# Altium schematic sheet schematics.SchDoc (part 2 of 3)
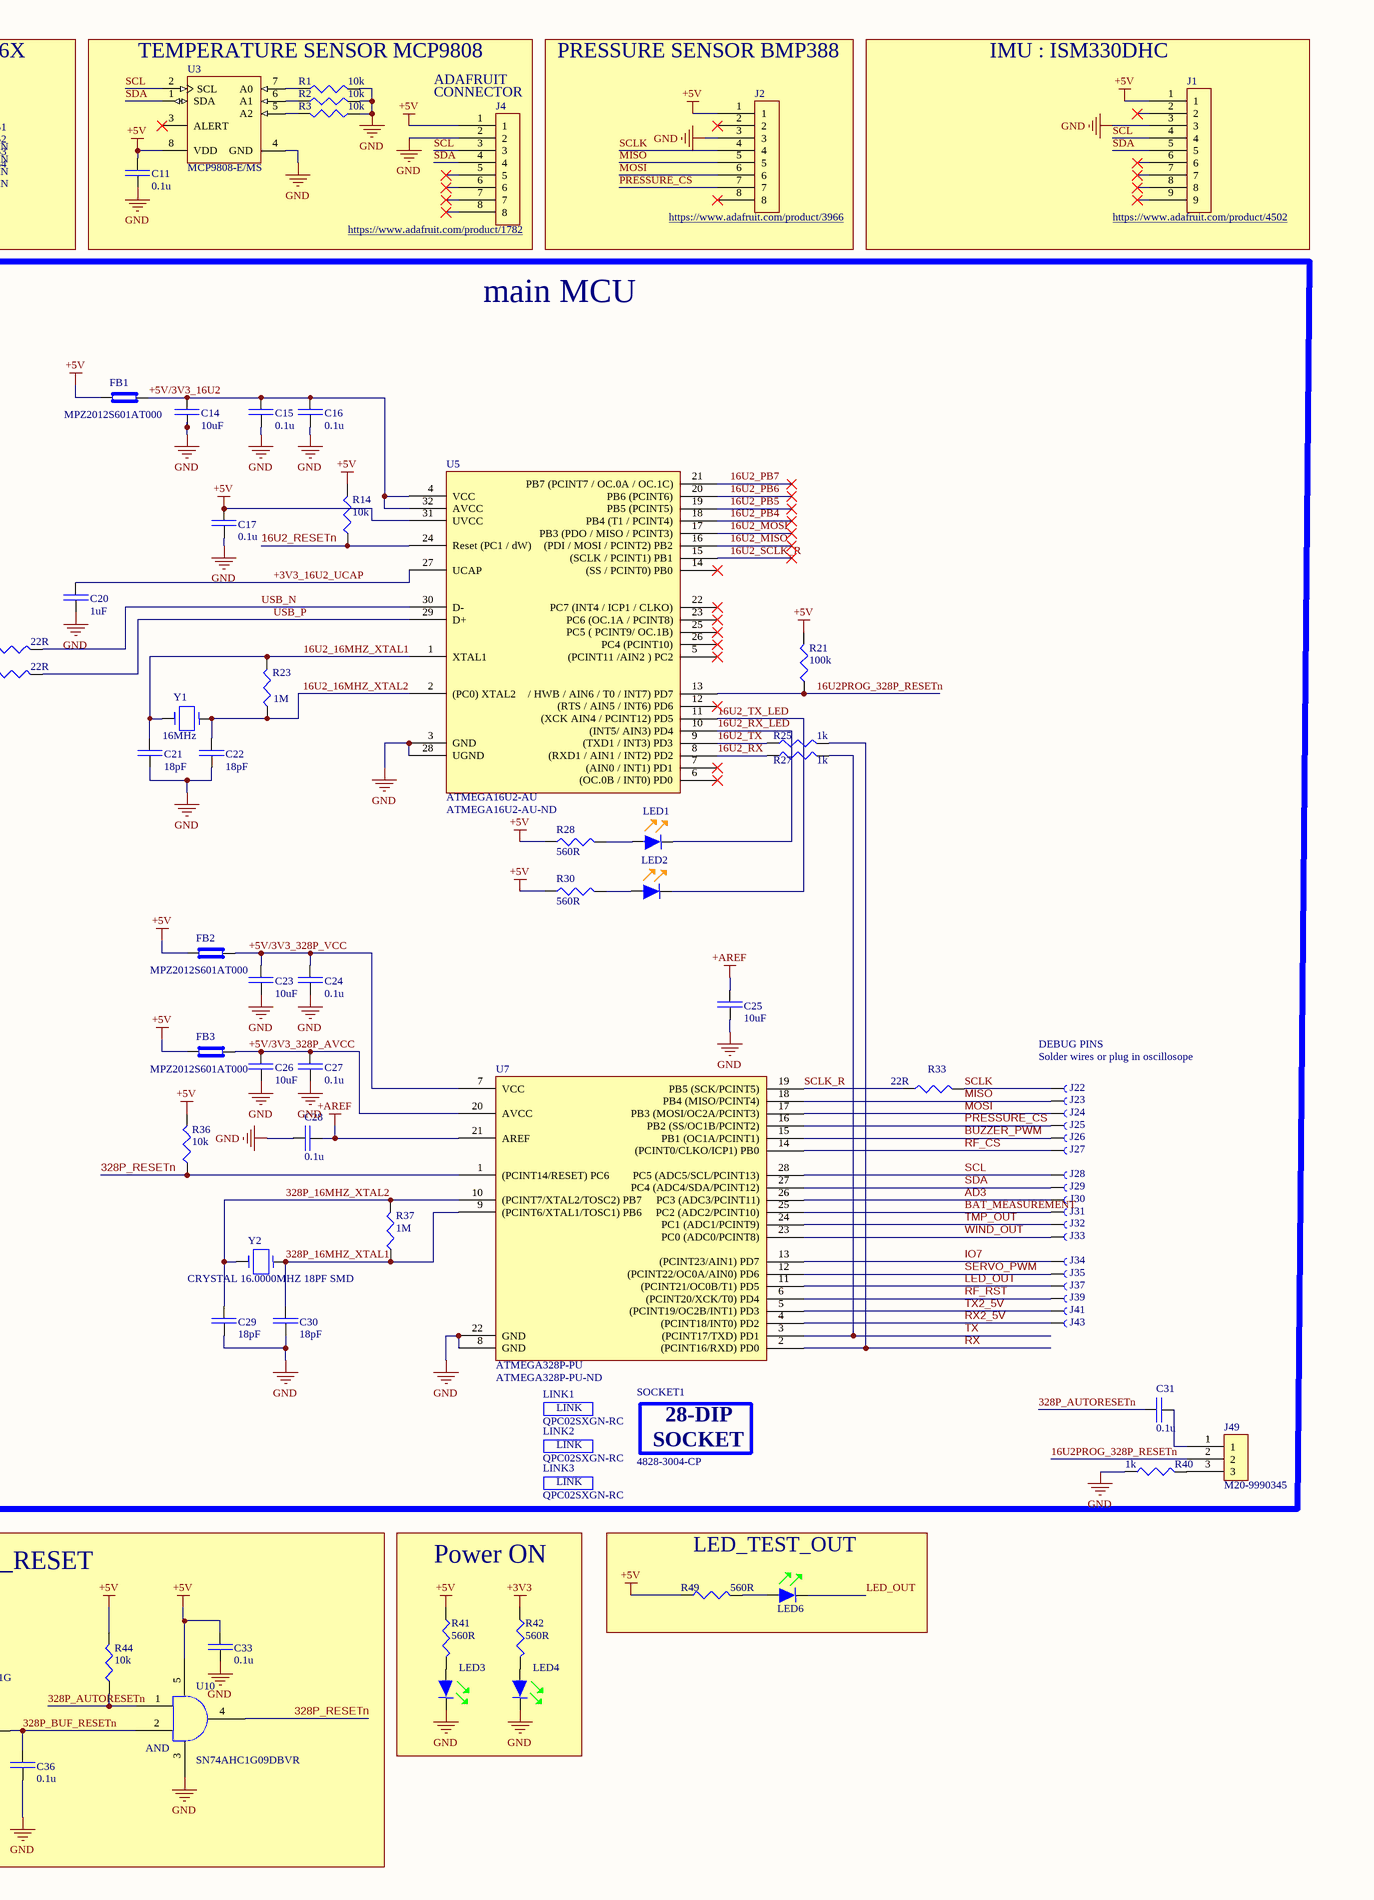
[diagram p2: schematics.SchDoc, right]
## Library data of the parts
BUZZER1 = PS1420P02CT: AUDIO PIEZO TRANSDUCER 30V TH; Manufacturer: TDK; Number of Terminals/Pins: 2; Frequency: 2kHz; Max Supply Voltage: 5V; Washable: No; Supplier 1: Digi-Key; Manufacturer Part Number: PS1420P02CT; RoHS: Yes; Category: Audio Products; Stock 1: 2916; Pricing 1: 1=0.72000, 10=0.61600, 25=0.57600, 50=0.54660, 100=0.51760 (USD); Mount: Through Hole; Case/Package: Radial; Min Operating Temperature: -10°C; Max Operating Temperature: 70°C; Termination: PC Pins; Packaging: Tape and Reel; Package Quantity: 1; Self Resonant Frequency: 2kHz; Voltage Rating (DC): 5V; Diameter: 14mm; Height: 11mm; Lead Free: Lead Free; REACH SVHC: No SVHC; ComponentLink1URL: https://datasheet.ciiva.com/1743/84905-1743655.pdf?src-supplier=Newark; ComponentLink1Description: https://datasheet.ciiva.com/1743/84905-1743655.pdf?src-supplier=Newark; ComponentLink2URL: https://datasheet.ciiva.com/1324/1740412-1324104.pdf?src-supplier=Element14; ComponentLink2Description: https://datasheet.ciiva.com/1324/1740412-1324104.pdf?src-supplier=Element14; ComponentLink3URL: https://datasheet.ciiva.com/4625/ef532-ps-4625338.pdf?src-supplier=Mouser; ComponentLink3Description: https://datasheet.ciiva.com/4625/ef532-ps-4625338.pdf?src-supplier=Mouser; ComponentLink4URL: https://datasheet.ciiva.com/16477/ef532-ps-16477598.pdf?src-supplier=Future+Electronics; ComponentLink4Description: https://datasheet.ciiva.com/16477/ef532-ps-16477598.pdf?src-supplier=Future+Electronics; ComponentLink5URL: https://datasheet.ciiva.com/0/ef532-ps-117.pdf?src-supplier=Digi-Key; ComponentLink5Description: https://datasheet.ciiva.com/0/ef532-ps-117.pdf?src-supplier=Digi-Key; ComponentLink6URL: https://datasheet.ciiva.com/0/ef532-ps-118.pdf?src-supplier=Digi-Key; ComponentLink6Description: https://datasheet.ciiva.com/0/ef532-ps-118.pdf?src-supplier=Digi-Key; ComponentLink7URL: https://datasheet.ciiva.com/8113/ef532-ps-8113417.pdf?src-supplier=Avnet; ComponentLink7Description: https://datasheet.ciiva.com/8113/ef532-ps-8113417.pdf?src-supplier=Avnet; Supplier Part Number 1: 445-2526-1-ND
C1 C6 C9 C11 C13 C15-C17 C24 C27 C28 C31 C33-C37 = CL10B104KB8NNNL: CL10 Series 0603 0.1 uF 50 V ±10% Tolerance X7R Multilayer Ceramic Capacitor; Manufacturer: Samsung; Capacitance: 100nF; Voltage Rating: 50V; Supplier 1: Digi-Key; Manufacturer Part Number: CL10B104KB8NNNL; RoHS: Yes; Category: Ceramic Capacitors; Stock 1: 4930902; Pricing 1: 1=0.10000, 10=0.02900, 50=0.01580, 100=0.01280, 500=0.00916, 1000=0.00720, 2500=0.00654, 5000=0.00602 (USD); Mount: Surface Mount; Case/Package: 0603; Min Operating Temperature: -55°C; Max Operating Temperature: 125°C; Tolerance: 10%; Dielectric: X7R; Packaging: Tape and Reel; Package Quantity: 15000; Voltage Rating (DC): 50V; Length: 1.6mm; Width: 0.031inch; Height: 0.8mm; Thickness: 0.035inch; Depth: 0.8mm; Radiation Hardening: No; ComponentLink1URL: https://datasheet.ciiva.com/26838/getdatasheetpartid-357523-26838415.pdf?src-supplier=Verical; ComponentLink1Description: https://datasheet.ciiva.com/26838/getdatasheetpartid-357523-26838415.pdf?src-supplier=Verical; ComponentLink2URL: https://datasheet.ciiva.com/25741/cl10b104kb8nnnl-25741341.pdf?src-supplier=Digi-Key; ComponentLink2Description: https://datasheet.ciiva.com/25741/cl10b104kb8nnnl-25741341.pdf?src-supplier=Digi-Key
  C1 C6 C9 C13 C24 C27 C28: Supplier Part Number 1: 1276-CL10B104KB8NNNLCT-ND
C2 = CMP-13271-004010-1: CL21 Series 0805 4.7uF 25V ±10% Tolerance X5R Multilayer Ceramic Chip Capacitor; Depth: 1.25mm; Package Quantity: 3000; Min Operating Temperature: -55°C; Tolerance: 10%; Radiation Hardening: No; Case Code (Imperial): 0805; Mount: Surface Mount; Length: 2mm; Lead Free: Lead Free; Case/Package: 0805; Voltage Rating: 25V; Case Code (Metric): 2012; Material: Ceramic; Voltage: 25V; Max Operating Temperature: 85°C; Width: 0.049inch; Thickness: 0.055inch; Dielectric: X5R; Height: 1.25mm; Packaging: Tape and Reel; Capacitance: 4.7uF
C3 = CMP-2100-03597-2: 0603 0.22 uF 16 V ±10 % Tolerance X7R SMT Multilayer Ceramic Capacitor; Manufacturer: YAGEO; Manufacturer Part Number: CC0603KRX7R7BB224; Voltage Rating: 16 V; Temperature Coefficient: 15%; Tolerance: 0.1; Lead Free: Yes; Device Class L3: Ceramic Capacitors; Device Class L2: Capacitors; Category: Cap; ComponentLink2Description: Datasheet; Value: 220 nF; Material: Ceramic; Capacitance: 220 nF; Footprint Url: http://www.yageo.com/exep/pages/download/literatures/UPY-C_GEN_24.pdf; Octopart: https://octopart.com/cc0603krx7r7bb224-yageo-6827757; Voltage: 16 V; ComponentLink2URL: http://www.yageo.com/documents/recent/UPY-GPHC_X7R_6.3V-to-50V_18.pdf; RoHS: TRUE; Temperature Range High: +125°C; Temperature Range Low: -55°C; Automotive: No; Digikey Description: 0603 0.22 uF 16 V ±10 % Tolerance X7R SMT Multilayer Ceramic Capacitor; Height: 0.9mm; Package: CC0603-DA; Mouser Description: Multilayer Ceramic Capacitors MLCC - SMD/SMT 220nF 16V X7R 10%; Temperature Characteristic: X7R; Device Class L1: Passive Components; Temperature: -55°C to +125°C
C4 C5 = CMP-13271-002013-1: Cap Ceramic 22uF 16V X5R ±20% SMD 1206 +85°C Embossed T/R; Height: 0.85mm; Min Operating Temperature: -55°C; Thickness: 0.037inch; Depth: 1.6mm; Length: 3.2mm; Tolerance: 20%; Case Code (Imperial): 1206; Capacitance: 22uF; Package Quantity: 1; Radiation Hardening: No; Case/Package: 1206; Dielectric: X5R; Packaging: Tape and Reel; Voltage: 16V; Case Code (Metric): 3216; Width: 0.063inch; Lead Free: Lead Free; Mount: Surface Mount; Voltage Rating: 16V; Max Operating Temperature: 85°C
C7 C21 C22 C29 C30 = 06035A180JAT2A: 0603 18 pF 50V ±5% Tolerance C0G/NP0 Surface Mount Multilayer Ceramic Capacitor; Manufacturer: Kyocera AVX; Dielectric: C0G; Insulation Resistance: 100GR; Temperature Coefficient: 30ppm/°C; Supplier 1: Digi-Key; Manufacturer Part Number: 06035A180JAT2A; RoHS: Yes; Category: Ceramic Capacitors; Stock 1: 137314; Pricing 1: 1=0.10000, 10=0.05700, 50=0.03100, 100=0.02530, 500=0.01810, 1000=0.01422 (USD); Mount: Surface Mount,PCB; Case/Package: 0603; Number of Pins: 2; Case Code (Imperial): 0603; Case Code (Metric): 1608; Contact Plating: Tin,Matte; Dielectric Material: Ceramic; Min Operating Temperature: -55°C; Max Operating Temperature: 125°C; Capacitance: 18pF; Tolerance: 5%; Packaging: Tape and Reel; Voltage Rating (DC): 50V; Voltage Rating: 50V; Package Quantity: 1; Termination: SMD/SMT; Voltage: 50V; Length: 1.6mm; Width: 0.81mm; Height: 0.63mm; Thickness: 0.035inch; Depth: 0.81mm; Radiation Hardening: No; REACH SVHC: No SVHC; Lead Free: Lead Free; ComponentLink1URL: https://datasheet.ciiva.com/1124/84496-1124722.pdf?src-supplier=Element14; ComponentLink1Description: https://datasheet.ciiva.com/1124/84496-1124722.pdf?src-supplier=Element14; ComponentLink2URL: https://datasheet.ciiva.com/150/ccog-150276.pdf?src-supplier=Digi-Key; ComponentLink2Description: https://datasheet.ciiva.com/150/ccog-150276.pdf?src-supplier=Digi-Key; ComponentLink3URL: https://datasheet.ciiva.com/150/ccog-150277.pdf?src-supplier=Digi-Key; ComponentLink3Description: https://datasheet.ciiva.com/150/ccog-150277.pdf?src-supplier=Digi-Key; ComponentLink4URL: https://datasheet.ciiva.com/7855/759117-7855062.pdf?src-supplier=Element14; ComponentLink4Description: https://datasheet.ciiva.com/7855/759117-7855062.pdf?src-supplier=Element14; ComponentLink5URL: https://datasheet.ciiva.com/7855/84496-7855222.pdf?src-supplier=Element14; ComponentLink5Description: https://datasheet.ciiva.com/7855/84496-7855222.pdf?src-supplier=Element14; ComponentLink6URL: https://datasheet.ciiva.com/22699/84496-22699967.pdf?src-supplier=Element14; ComponentLink6Description: https://datasheet.ciiva.com/22699/84496-22699967.pdf?src-supplier=Element14; Supplier Part Number 1: 478-1166-1-ND
C8 C12 = CMP-13271-000003-1: CAP CER 0.33UF 50V X7R 0805; Manufacturer: Samsung Electro-Mechanics; Manufacturer Part Number: CL21B334KBFNNNE; Capacitance: 330nF; Temperature Coefficient: 15%; Value: 330nF; Material: Ceramic; Tolerance: 10%; Category: Cap; Temperature Range Low: -55°C; Height: 1.35mm; Ipc Land Pattern Name: CAPC200125X125; ComponentLink2URL: http://www.samsungsem.com/kr/support/product-search/mlcc/__icsFiles/afieldfile/2018/07/24/CL21B334KBFNNNE.pdf; Octopart: https://octopart.com/cl21b334kbfnnne-samsung-9287149; Digikey Description: CAP CER 0.33UF 50V X7R 0805; Automotive: No; ComponentLink2Description: Datasheet; Lead Free: Yes; Voltage Rating: 50V; Device Class L2: Capacitors; Device Class L1: Passive Components; RoHS: TRUE; Temperature: -55°C to +125°C; Package: CL21-F; Temperature Range High: +125°C; Temperature Characteristic: X7R; Device Class L3: Ceramic Capacitors
C10 C20 = CC0603KRX5R8BB105: YAGEO - CC0603KRX5R8BB105 - SMD Multilayer Ceramic Capacitor, 1 &#181;F, 25 V, 0603 [1608 Metric], &#177; 10%, X5R, CC Series; Voltage Rating: 25V; Supplier 1: Digi-Key; Manufacturer: Yageo; Manufacturer Part Number: CC0603KRX5R8BB105; RoHS: Yes; Category: Ceramic Capacitors; Stock 1: 1653494; Pricing 1: 1=0.11000, 10=0.08000, 50=0.04560, 100=0.03770, 500=0.02644, 1000=0.02189 (USD); Mount: Surface Mount; Case/Package: 0603; Number of Pins: 2; Case Code (Metric): 1608; Case Code (Imperial): 0603; Min Operating Temperature: -55°C; Max Operating Temperature: 85°C; Capacitance: 1uF; Tolerance: 10%; Dielectric: X5R; Package Quantity: 1; Packaging: Tape and Reel; Termination: SMD/SMT; Voltage Rating (DC): 25V; Length: 1.6mm; Width: 0.031inch; Height: 0.8mm; Thickness: 0.035inch; Depth: 0.8mm; Radiation Hardening: No; REACH SVHC: No SVHC; Lead Free: Lead Free; Halogen Free: Halogen Free; ComponentLink1URL: https://datasheet.ciiva.com/176/mlccorderingcode-176785.pdf?src-supplier=Digi-Key; ComponentLink1Description: https://datasheet.ciiva.com/176/mlccorderingcode-176785.pdf?src-supplier=Digi-Key; ComponentLink2URL: https://datasheet.ciiva.com/176/mlccorderingcode-176786.pdf?src-supplier=Digi-Key; ComponentLink2Description: https://datasheet.ciiva.com/176/mlccorderingcode-176786.pdf?src-supplier=Digi-Key; ComponentLink3URL: https://datasheet.ciiva.com/176/mlccorderingcode-176787.pdf?src-supplier=Digi-Key; ComponentLink3Description: https://datasheet.ciiva.com/176/mlccorderingcode-176787.pdf?src-supplier=Digi-Key; ComponentLink4URL: https://datasheet.ciiva.com/17436/upy-gphc-x5r-4v-to-50v-12-17436952.pdf?src-supplier=Avnet+Europe; ComponentLink4Description: https://datasheet.ciiva.com/17436/upy-gphc-x5r-4v-to-50v-12-17436952.pdf?src-supplier=Avnet+Europe; ComponentLink5URL: https://datasheet.ciiva.com/7978/1525783-7978171.pdf?src-supplier=Element14; ComponentLink5Description: https://datasheet.ciiva.com/7978/1525783-7978171.pdf?src-supplier=Element14; ComponentLink6URL: https://datasheet.ciiva.com/11586/upy-gphc-x5r-4v-to-50v-12-11586318.pdf?src-supplier=Avnet; ComponentLink6Description: https://datasheet.ciiva.com/11586/upy-gphc-x5r-4v-to-50v-12-11586318.pdf?src-supplier=Avnet; Supplier Part Number 1: 311-1445-1-ND
C14 C23 C25 C26 C32 = CL21A106KOQNNNG: Ceramic capacitor SMD 0805 10 µF 16 V 10 %; Manufacturer: Samsung; Tolerance: 10%; Dielectric: X5R; Voltage: 16V; Supplier 1: Digi-Key; Manufacturer Part Number: CL21A106KOQNNNG; RoHS: Yes; Category: Ceramic Capacitors; Stock 1: 763943; Pricing 1: 1=0.11000, 10=0.08300, 50=0.04500, 100=0.03680, 500=0.02626, 1000=0.02063 (USD); Mount: Surface Mount; Case/Package: 0805; Case Code (Imperial): 0805; Case Code (Metric): 2012; Material: Ceramic; Min Operating Temperature: -55°C; Max Operating Temperature: 85°C; Capacitance: 10uF; Packaging: Tape and Reel; Package Quantity: 3000; Voltage Rating: 16V; Length: 2mm; Width: 0.049inch; Height: 1.25mm; Depth: 1.25mm; Thickness: 0.053inch; ComponentLink1URL: https://datasheet.ciiva.com/25730/cl21a106koqnnng-25730226.pdf?src-supplier=Digi-Key; ComponentLink1Description: https://datasheet.ciiva.com/25730/cl21a106koqnnng-25730226.pdf?src-supplier=Digi-Key; ComponentLink2URL: https://datasheet.ciiva.com/29199/454932-da-01-en-vs-kondensator-0805-29199423.pdf?src-supplier=Conrad; ComponentLink2Description: https://datasheet.ciiva.com/29199/454932-da-01-en-vs-kondensator-0805-29199423.pdf?src-supplier=Conrad
  C23 C26 C32: Supplier Part Number 1: 1276-6455-1-ND
C18 C19 = EEE-1AA101WR: Cap Aluminum 100uF 10V 20% (5 X 5.4mm) SMD 50mA 1000 hr 85°C T/R; Manufacturer: Panasonic; Life (Hours): 1000Hour; Supplier 1: Digi-Key; Manufacturer Part Number: EEE-1AA101WR; RoHS: Yes; Category: Aluminum Electrolytic Capacitors; Stock 1: 120721; Pricing 1: 1=0.35000, 10=0.24300, 50=0.16180, 100=0.13740, 500=0.09702 (USD); Mount: Surface Mount,PCB; Case/Package: Radial; Contact Plating: Tin; Min Operating Temperature: -40°C; Max Operating Temperature: 85°C; Capacitance: 100uF; Tolerance: 20%; Ripple Current: 50mA; Voltage Rating: 10V; Packaging: Tape and Reel; Package Quantity: 1; Voltage Rating (DC): 10V; Termination: SMD/SMT; Ripple Current (AC): 50mA; Diameter: 5mm; Length: 5.5mm; Height: 5.4mm; Height - Seated (Max): 0.213inch; Radiation Hardening: No; Lead Free: Lead Free; REACH SVHC: Unknown; ComponentLink1URL: https://datasheet.ciiva.com/26945/getdatasheetpartid-169213-26945071.pdf?src-supplier=Verical; ComponentLink1Description: https://datasheet.ciiva.com/26945/getdatasheetpartid-169213-26945071.pdf?src-supplier=Verical; ComponentLink2URL: https://datasheet.ciiva.com/2983/aba0000ce2-2983906.pdf?src-supplier=Avnet; ComponentLink2Description: https://datasheet.ciiva.com/2983/aba0000ce2-2983906.pdf?src-supplier=Avnet; ComponentLink3URL: https://datasheet.ciiva.com/30075/11aba0000ce2-30075303.pdf?src-supplier=Onlinecomponents.com; ComponentLink3Description: https://datasheet.ciiva.com/30075/11aba0000ce2-30075303.pdf?src-supplier=Onlinecomponents.com; ComponentLink4URL: https://datasheet.ciiva.com/16427/aba0000ce2-16427544.pdf?src-supplier=Future+Electronics; ComponentLink4Description: https://datasheet.ciiva.com/16427/aba0000ce2-16427544.pdf?src-supplier=Future+Electronics; ComponentLink5URL: https://datasheet.ciiva.com/14598/70255710-14598233.pdf?src-supplier=Allied+Electronics; ComponentLink5Description: https://datasheet.ciiva.com/14598/70255710-14598233.pdf?src-supplier=Allied+Electronics; ComponentLink6URL: https://datasheet.ciiva.com/14605/70255710-14605689.pdf?src-supplier=Allied+Electronics; ComponentLink6Description: https://datasheet.ciiva.com/14605/70255710-14605689.pdf?src-supplier=Allied+Electronics; ComponentLink7URL: https://datasheet.ciiva.com/11673/aba0000ce2-11673882.pdf?src-supplier=Avnet; ComponentLink7Description: https://datasheet.ciiva.com/11673/aba0000ce2-11673882.pdf?src-supplier=Avnet; ComponentLink8URL: https://datasheet.ciiva.com/24027/aba0000ce2-40801-24027541.pdf?src-supplier=Mouser; ComponentLink8Description: https://datasheet.ciiva.com/24027/aba0000ce2-40801-24027541.pdf?src-supplier=Mouser; Supplier Part Number 1: PCE3867CT-ND
D1 D2 = BAT54HT1G: Small Signal Schottky Diode, Single, 30 V, 200 mA, 800 mV, 600 mA, 150 C ;RoHS Compliant: Yes; Manufacturer: ON Semiconductor / Fairchild; Forward Voltage: 800mV; Forward Current: 200mA; Recovery Time: 5ns; Max Repetitive Reverse Voltage (Vrrm): 30V; Peak Non-Repetitive Surge Current: 600mA; Max Reverse Current: 2uA; Power Dissipation: 200mW; Polarity: Standard; Capacitance: 10pF; Supplier 1: Digi-Key; Manufacturer Part Number: BAT54HT1G; RoHS: Yes; Category: Schottky Diodes; Stock 1: 187838; Pricing 1: 1=0.20000, 10=0.18100, 100=0.07590, 500=0.05962, 1000=0.04140 (USD); Mount: Surface Mount; Number of Pins: 2; Contact Plating: Tin,Matte; Min Operating Temperature: -55°C; Max Operating Temperature: 150°C; Packaging: Tape and Reel; Package Quantity: 3000; Average Rectified Current: 200mA; Reverse Recovery Time: 5ns; Max Forward Surge Current (Ifsm): 600mA; Element Configuration: Single; Max Reverse Voltage (DC): 30V; Max Surge Current: 600mA; Voltage Rating (DC): 30V; Current Rating: 200mA; Output Current: 200mA; Reverse Voltage: 30V; Max Reverse Leakage Current: 2uA; Length: 1.8mm; Width: 1.35mm; Height: 1mm; Radiation Hardening: No; Lead Free: Lead Free; REACH SVHC: No SVHC; ComponentLink1URL: https://datasheet.ciiva.com/4452/bat54ht1g-104602-4452889.pdf?src-supplier=Mouser; ComponentLink1Description: https://datasheet.ciiva.com/4452/bat54ht1g-104602-4452889.pdf?src-supplier=Mouser; ComponentLink2URL: https://datasheet.ciiva.com/1240/1747983-1240762.pdf?src-supplier=Newark; ComponentLink2Description: https://datasheet.ciiva.com/1240/1747983-1240762.pdf?src-supplier=Newark; ComponentLink3URL: https://datasheet.ciiva.com/34301/806549-34301562.pdf?src-supplier=Jameco; ComponentLink3Description: https://datasheet.ciiva.com/34301/806549-34301562.pdf?src-supplier=Jameco; ComponentLink4URL: https://datasheet.ciiva.com/30479/0900766b811a63a9-30479442.pdf?src-supplier=RSComponents; ComponentLink4Description: https://datasheet.ciiva.com/30479/0900766b811a63a9-30479442.pdf?src-supplier=RSComponents; ComponentLink5URL: https://datasheet.ciiva.com/4714/bat54ht1-d-72881-4714706.pdf?src-supplier=Mouser; ComponentLink5Description: https://datasheet.ciiva.com/4714/bat54ht1-d-72881-4714706.pdf?src-supplier=Mouser; ComponentLink6URL: https://datasheet.ciiva.com/910/bat54ht1g-910498.pdf?src-supplier=Digi-Key; ComponentLink6Description: https://datasheet.ciiva.com/910/bat54ht1g-910498.pdf?src-supplier=Digi-Key; ComponentLink7URL: https://datasheet.ciiva.com/46429/1727620-46429206.pdf?src-supplier=Element14; ComponentLink7Description: https://datasheet.ciiva.com/46429/1727620-46429206.pdf?src-supplier=Element14; ComponentLink8URL: https://datasheet.ciiva.com/915/bat54ht1-d-915444.pdf?src-supplier=Digi-Key; ComponentLink8Description: https://datasheet.ciiva.com/915/bat54ht1-d-915444.pdf?src-supplier=Digi-Key; ComponentLink9URL: https://datasheet.ciiva.com/910/bat54ht1g-910499.pdf?src-supplier=Digi-Key; ComponentLink9Description: https://datasheet.ciiva.com/910/bat54ht1g-910499.pdf?src-supplier=Digi-Key; ComponentLink10URL: https://datasheet.ciiva.com/8303/bat54ht1g-8303645.pdf?src-supplier=Avnet; ComponentLink10Description: https://datasheet.ciiva.com/8303/bat54ht1g-8303645.pdf?src-supplier=Avnet; ComponentLink11URL: https://datasheet.ciiva.com/1180/bat54ht1-d-1180251.pdf?src-supplier=Element14; ComponentLink11Description: https://datasheet.ciiva.com/1180/bat54ht1-d-1180251.pdf?src-supplier=Element14; ComponentLink12URL: https://datasheet.ciiva.com/1180/bat54ht1-d-1180252.pdf?src-supplier=Element14; ComponentLink12Description: https://datasheet.ciiva.com/1180/bat54ht1-d-1180252.pdf?src-supplier=Element14; ComponentLink13URL: https://datasheet.ciiva.com/8294/bat54ht1-d-8294645.pdf?src-supplier=Avnet; ComponentLink13Description: https://datasheet.ciiva.com/8294/bat54ht1-d-8294645.pdf?src-supplier=Avnet; ComponentLink14URL: https://datasheet.ciiva.com/915/bat54ht1-d-915445.pdf?src-supplier=Digi-Key; ComponentLink14Description: https://datasheet.ciiva.com/915/bat54ht1-d-915445.pdf?src-supplier=Digi-Key; ComponentLink15URL: https://datasheet.ciiva.com/915/bat54ht1-d-915443.pdf?src-supplier=Digi-Key; ComponentLink15Description: https://datasheet.ciiva.com/915/bat54ht1-d-915443.pdf?src-supplier=Digi-Key; ComponentLink16URL: https://datasheet.ciiva.com/910/bat54ht1g-910497.pdf?src-supplier=Digi-Key; ComponentLink16Description: https://datasheet.ciiva.com/910/bat54ht1g-910497.pdf?src-supplier=Digi-Key; ComponentLink17URL: https://datasheet.ciiva.com/17020/bat54ht1g-17020445.pdf?src-supplier=Future+Electronics; ComponentLink17Description: https://datasheet.ciiva.com/17020/bat54ht1g-17020445.pdf?src-supplier=Future+Electronics; ComponentLink18URL: https://datasheet.ciiva.com/48686/001262925-da-01-en-diode-schottky-30v-bat54ht1g-sod-323-fsc-48686266.pdf?src-supplier=Conrad; ComponentLink18Description: https://datasheet.ciiva.com/48686/001262925-da-01-en-diode-schottky-30v-bat54ht1g-sod-323-fsc-48686266.pdf?src-supplier=Conrad; Supplier Part Number 1: BAT54HT1GOSCT-ND
FB1-FB3 = MPZ2012S601AT000: FERRITE BEAD 600 OHM 0805 1LN; Manufacturer: TDK; Impedance: 600R; Current Rating: 2A; DC Resistance (DCR): 100mR; Supplier 1: Digi-Key; Manufacturer Part Number: MPZ2012S601AT000; RoHS: Yes; Category: Ferrite Beads and Chips; Stock 1: 163632; Pricing 1: 1=0.11000, 10=0.09200, 25=0.08240, 50=0.06040, 100=0.05220, 250=0.04116, 500=0.03478, 1000=0.02928 (USD); Mount: Surface Mount; Case/Package: 0805; Case Code (Metric): 2012; Case Code (Imperial): 0805; Packaging: Tape and Reel; Package Quantity: 1; Max DC Current: 2A; Length: 0.079inch; Width: 0.049inch; Height: 0.041inch; REACH SVHC: No SVHC; Lead Free: Lead Free; ComponentLink1URL: https://datasheet.ciiva.com/46634/beads-commercial-power-mpz-en-46634377.pdf?src-supplier=Digi-Key; ComponentLink1Description: https://datasheet.ciiva.com/46634/beads-commercial-power-mpz-en-46634377.pdf?src-supplier=Digi-Key; ComponentLink2URL: https://datasheet.ciiva.com/46634/beads-commercial-power-mpz-en-46634606.pdf?src-supplier=Digi-Key; ComponentLink2Description: https://datasheet.ciiva.com/46634/beads-commercial-power-mpz-en-46634606.pdf?src-supplier=Digi-Key; ComponentLink3URL: https://datasheet.ciiva.com/46634/beads-commercial-power-mpz-en-46634335.pdf?src-supplier=Digi-Key; ComponentLink3Description: https://datasheet.ciiva.com/46634/beads-commercial-power-mpz-en-46634335.pdf?src-supplier=Digi-Key; Supplier Part Number 1: 445-2206-1-ND
J1 = ISM330DHCX_adafruit: https://www.adafruit.com/product/4502#technical-details
J2 = BMP388_adafruit: Manufacturer: Harwin; Manufacturer Part Number: M20-7820842; Number of Contacts: 8; Connector Type: Receptacle,Socket; Gender: Female; Max Current Rating: 3A; Contact Resistance: 20mR; Pitch: 2.54mm; Supplier 1: Digi-Key; RoHS: Yes; Category: Headers and Wire Housings; Stock 1: 384; Pricing 1: 1=1.17000, 10=1.03000, 100=0.88880, 500=0.72720, 1000=0.64640, 5000=0.56560, 10000=0.53732 (USD); Mount: Through Hole; Case/Package: SIL; Contact Plating: Tin,Gold; Weight: 0.025397oz; Housing Color: Black; Color: Black; Contact Material: Bronze; Housing Material: Polyamide; Min Operating Temperature: -40°C; Max Operating Temperature: 105°C; Termination: Solder; Number of Rows: 1; Orientation: Straight; Number of Positions: 8; Contact Gender: Female; Package Quantity: 29; Packaging: Rail/Tube; Length: 20.72mm; Depth: 2.5mm; Radiation Hardening: No; ComponentLink1URL: https://datasheet.ciiva.com/16732/m20-782-16732663.pdf?src-supplier=Avnet+Europe; ComponentLink1Description: https://datasheet.ciiva.com/16732/m20-782-16732663.pdf?src-supplier=Avnet+Europe; ComponentLink2URL: https://datasheet.ciiva.com/9480/m20-782-9480074.pdf?src-supplier=Avnet; ComponentLink2Description: https://datasheet.ciiva.com/9480/m20-782-9480074.pdf?src-supplier=Avnet; Supplier Part Number 1: 952-1823-ND
J4 = MCP9808_adafruit
J17 = M20-9760346: 03+03 DIL VERT PIN HDR; Manufacturer: Harwin; Current Rating: 3A; Voltage Rating: 750V; Connector Type: Male Pin; Contact Resistance: 30mR; Number of Positions: 6; Pitch: 2.54mm; Row Spacing: 0.1inch; Supplier 1: Digi-Key; Manufacturer Part Number: M20-9760346; RoHS: Yes; Category: Headers and Wire Housings; Stock 1: 4331; Pricing 1: 1=0.25000, 10=0.23300, 100=0.16120, 500=0.13640, 1000=0.11160, 5000=0.09920, 10000=0.08990 (USD); Mount: Through Hole; Housing Color: Black; Color: Black; Contact Plating: Tin; Housing Material: Nylon; Contact Material: Brass; Min Operating Temperature: -40°C; Max Operating Temperature: 105°C; Orientation: Straight; Package Quantity: 1000; Number of Rows: 2; Packaging: Bulk; Max Current Rating: 3A; Termination: Solder; Length: 7.62mm; Contact Mating Length: 0.228inch; Depth: 5.08mm; ComponentLink1URL: https://datasheet.ciiva.com/6814/m20-976-6814764.pdf?src-supplier=Digi-Key; ComponentLink1Description: https://datasheet.ciiva.com/6814/m20-976-6814764.pdf?src-supplier=Digi-Key; Supplier Part Number 1: 952-1779-ND
J18 = M20-9990546 (3): HEADER, 1ROW, 5WAY; Manufacturer: Harwin; Number of Contacts: 5; Connector Type: Male Pin; Gender: Male; Insulation Resistance: 10GR; Max Current Rating: 3A; Contact Resistance: 30mR; Pitch: 2.54mm; Supplier 1: Digi-Key; Manufacturer Part Number: M20-9990546; RoHS: Yes; Category: Headers and Wire Housings; Stock 1: 48472; Pricing 1: 1=0.21000, 10=0.19500, 100=0.13520, 500=0.11440, 1000=0.09360, 5000=0.08320, 10000=0.07540 (USD); Mount: Through Hole; Case/Package: SIL; Housing Material: Nylon; Contact Material: Brass,Bronze; Contact Plating: Tin; Color: Black; Housing Color: Black; Min Operating Temperature: -40°C; Max Operating Temperature: 105°C; Termination: Solder; Number of Rows: 1; Number of Positions: 5; Current Rating: 3A; Package Quantity: 1000; Packaging: Bulk; Orientation: Straight; Length: 12.7mm; Contact Mating Length: 0.24inch; Depth: 2.54mm; REACH SVHC: No SVHC; ComponentLink1URL: https://datasheet.ciiva.com/11749/0900766b80da602d-11749062.pdf?src-supplier=RSComponents; ComponentLink1Description: https://datasheet.ciiva.com/11749/0900766b80da602d-11749062.pdf?src-supplier=RSComponents; ComponentLink2URL: https://datasheet.ciiva.com/8046/315376-8046940.pdf?src-supplier=Element14; ComponentLink2Description: https://datasheet.ciiva.com/8046/315376-8046940.pdf?src-supplier=Element14; ComponentLink3URL: https://datasheet.ciiva.com/6833/m20-999-6833320.pdf?src-supplier=Digi-Key; ComponentLink3Description: https://datasheet.ciiva.com/6833/m20-999-6833320.pdf?src-supplier=Digi-Key; Supplier Part Number 1: 952-2268-ND
J19 = 10118193-0001LF: CONN USB MICRO B RECPT SMT R/A; Manufacturer: Amphenol FCI; Number of Terminals/Pins: 5; Gender: Female; Connector Type: USB,Receptacle; Number of Ports: 1; Current Rating: 1.8A; Insulation Resistance: 1GR; Max Voltage Rating (AC): 100V; Pitch: 0.65mm; Supplier 1: Digi-Key; Manufacturer Part Number: 10118193-0001LF; RoHS: Yes; Category: USB Connectors; Stock 1: 43804; Pricing 1: 1=0.45000, 10=0.43000, 25=0.36840, 50=0.31320, 100=0.30090, 250=0.27016, 500=0.25788 (USD); Mount: Surface Mount,Horizontal; Contact Plating: Gold; Contact Material: Copper Alloy; Color: Black; Housing Material: Polymer; Min Operating Temperature: -55°C; Max Operating Temperature: 85°C; Termination: Solder; Packaging: Tape and Reel; Number of Contacts: 5; Orientation: Right Angle; Package Quantity: 1200; Voltage Rating: 100V; Features: Shielded; Length: 7.86mm; Depth: 5.67mm; Radiation Hardening: No; Flammability Rating: UL94 V-0; ComponentLink1URL: https://datasheet.ciiva.com/851/10118193-851106.pdf?src-supplier=Digi-Key; ComponentLink1Description: https://datasheet.ciiva.com/851/10118193-851106.pdf?src-supplier=Digi-Key; ComponentLink2URL: https://datasheet.ciiva.com/26853/getdatasheetpartid-418618-26853893.pdf?src-supplier=Verical; ComponentLink2Description: https://datasheet.ciiva.com/26853/getdatasheetpartid-418618-26853893.pdf?src-supplier=Verical; ComponentLink3URL: https://datasheet.ciiva.com/4598/10118193ac-197151-4598799.pdf?src-supplier=Mouser; ComponentLink3Description: https://datasheet.ciiva.com/4598/10118193ac-197151-4598799.pdf?src-supplier=Mouser; ComponentLink4URL: https://datasheet.ciiva.com/14802/10118193-0001lf-webpage-14802386.pdf?src-supplier=Arrow+Electronics; ComponentLink4Description: https://datasheet.ciiva.com/14802/10118193-0001lf-webpage-14802386.pdf?src-supplier=Arrow+Electronics; ComponentLink5URL: https://datasheet.ciiva.com/851/10118193-851107.pdf?src-supplier=Digi-Key; ComponentLink5Description: https://datasheet.ciiva.com/851/10118193-851107.pdf?src-supplier=Digi-Key; ComponentLink6URL: https://datasheet.ciiva.com/851/10118193-851108.pdf?src-supplier=Digi-Key; ComponentLink6Description: https://datasheet.ciiva.com/851/10118193-851108.pdf?src-supplier=Digi-Key; ComponentLink7URL: https://datasheet.ciiva.com/14618/70236827-14618887.pdf?src-supplier=Allied+Electronics; ComponentLink7Description: https://datasheet.ciiva.com/14618/70236827-14618887.pdf?src-supplier=Allied+Electronics; Supplier Part Number 1: 609-4616-1-ND
J21 J49 = M20-9990345: HARWIN - M20-9990345 - Board-To-Board Connector, Straight, 2.54 mm, 3 Contacts, Header, M20 Series, Through Hole, 1 Rows; Number of Contacts: 3; Connector Type: Male Pin; Current Rating: 3A; Contact Resistance: 25mR; Voltage Rating (AC): 750V; Insulation Resistance: 10GR; Pitch: 2.54mm; Supplier 1: Digi-Key; Manufacturer: Harwin; Manufacturer Part Number: M20-9990345; RoHS: Yes; Category: Headers and Wire Housings; Stock 1: 68267; Pricing 1: 1=0.19000, 10=0.17400, 100=0.10730, 500=0.08880, 1000=0.07770, 5000=0.06660, 10000=0.06475 (USD); Mount: Through Hole; Case/Package: SIL; Housing Color: Black; Housing Material: Nylon; Contact Plating: Gold; Contact Material: Brass,Bronze; Color: Black; Weight: 0.006138oz; Min Operating Temperature: -40°C; Max Operating Temperature: 105°C; Number of Rows: 1; Termination: Solder; Package Quantity: 1000; Packaging: Bulk; Max Current Rating: 3A; Number of Positions: 3; Orientation: Straight; Length: 7.62mm; Width: 0.25inch; Height: 0.125inch; Contact Mating Length: 0.24inch; Depth: 2.54mm; Radiation Hardening: No; REACH SVHC: No SVHC; ComponentLink1URL: https://datasheet.ciiva.com/11747/0900766b80da602d-11747505.pdf?src-supplier=RSComponents; ComponentLink1Description: https://datasheet.ciiva.com/11747/0900766b80da602d-11747505.pdf?src-supplier=RSComponents; ComponentLink2URL: https://datasheet.ciiva.com/10151/m20-999-10151334.pdf?src-supplier=Avnet; ComponentLink2Description: https://datasheet.ciiva.com/10151/m20-999-10151334.pdf?src-supplier=Avnet; ComponentLink3URL: https://datasheet.ciiva.com/16657/m20-999-16657084.pdf?src-supplier=Avnet+Europe; ComponentLink3Description: https://datasheet.ciiva.com/16657/m20-999-16657084.pdf?src-supplier=Avnet+Europe; ComponentLink4URL: https://datasheet.ciiva.com/5160/m20-999-351179-5160492.pdf?src-supplier=Mouser; ComponentLink4Description: https://datasheet.ciiva.com/5160/m20-999-351179-5160492.pdf?src-supplier=Mouser; Supplier Part Number 1: 952-2263-ND
J50 = CMP-2000-05415-1: SMA Connector, Pitch 5.08 mm, 1 Position, Height 9.5 mm, Tail Length 4 mm, -65 to 165 degC, RoHS, Bulk; Manufacturer: TE Connectivity; Connector Mounting: PCBMount; Connector Body Style: StraightJack; Impedance: 50ohm; Coaxial Termination: Solder; SVHC: NoSVHC(15-Jun-2015); Frequency Max: 3GHz; Product Range: ZDCSeries; Connector Type: SMACoaxial; Datasheet Version: Rev. B1, 03/2011; Package Reference: 5-1814832-1; Package Description: SMA Connector, Pitch 5.08 mm, 1 Position, Height 9.5 mm, Tail Length 4 mm; Contact Plating: GoldPlatedContacts; Coaxial Cable Types: -; Contact Material: BerylliumCopper; Manufacturer URL: http://www.te.com/; Datasheet URL: http://www.onlinecomponents.com/productFiles/mf-AMP/eng_cd_1814832_a.pdf
L1 = ASPI-4020S-120M-T: Ind Power Shielded Wirewound 12uH 20% 100KHz Ferrite 880mA 1616 T/R; Manufacturer: Abracon; DC Resistance (DCR): 175mR; Max DC Current: 1.5A; Self Resonant Frequency: 26MHz; Supplier 1: Digi-Key; Manufacturer Part Number: ASPI-4020S-120M-T; RoHS: Yes; Category: Fixed Inductors; Pricing 1: 3000=0.16800 (USD); Mount: Surface Mount; Case/Package: Nonstandard; Core Material: Ferrite; Min Operating Temperature: -40°C; Max Operating Temperature: 125°C; Shielding: Shielded; Packaging: Tape and Reel; Tolerance: 20%; Resistor Type: Wirewound; Inductance: 12uH; Current Rating: 880mA; Test Frequency: 100kHz; Termination: SMD/SMT; Package Quantity: 3000; Saturation Current: 1.5A; Length: 0.157inch; Width: 0.157inch; Height: 2mm; Height - Seated (Max): 0.079inch; ComponentLink1URL: http://www.mouser.com/ds/2/3/ASPI-4020S-253634.pdf?src-supplier=Mouser; ComponentLink1Description: http://www.mouser.com/ds/2/3/ASPI-4020S-253634.pdf?src-supplier=Mouser; ComponentLink2URL: http://www.abracon.com/Magnetics/power/ASPI-4020S.pdf?src-supplier=Digi-Key; ComponentLink2Description: http://www.abracon.com/Magnetics/power/ASPI-4020S.pdf?src-supplier=Digi-Key; Supplier Part Number 1: ASPI-4020S-120M-T-ND
L2 = L1210R2R2MDWIT: FIXED IND 2.2UH 2A 80 MOHM SMD; Manufacturer: KEMET; Core Material: Ferrite; Tolerance: 20%; Shielding: Unshielded; Self Resonant Frequency: 190MHz; DC Resistance (DCR): 80mR; Test Frequency: 100kHz; DC Current: 1.13A; Supplier 1: Digi-Key; Manufacturer Part Number: L1210R2R2MDWIT; RoHS: Yes; Category: Fixed Inductors; Stock 1: 16682; Pricing 1: 1=0.48000, 10=0.41700, 25=0.38680, 50=0.32720, 100=0.29750, 250=0.27964, 500=0.24990 (USD); Mount: Surface Mount; Case/Package: 1210; Case Code (Metric): 3225; Case Code (Imperial): 1210; Min Operating Temperature: -40°C; Max Operating Temperature: 105°C; Inductance: 2.2uH; Max DC Current: 2A; Package Quantity: 1000; Current Rating: 2A; Packaging: Tape and Reel; Inductance Tolerance: 20%; Resistor Type: Wirewound,Ceramic; Termination: SMD/SMT; Length: 0.126inch; Width: 0.098inch; Height: 2.5mm; Height - Seated (Max): 0.106inch; Depth: 2.7mm; Radiation Hardening: No; REACH SVHC: No SVHC; Military Standard: Not; ComponentLink1URL: https://datasheet.ciiva.com/4957/f3115-4957838.pdf?src-supplier=Mouser; ComponentLink1Description: https://datasheet.ciiva.com/4957/f3115-4957838.pdf?src-supplier=Mouser; ComponentLink2URL: https://datasheet.ciiva.com/6691/f3115-6691487.pdf?src-supplier=Digi-Key; ComponentLink2Description: https://datasheet.ciiva.com/6691/f3115-6691487.pdf?src-supplier=Digi-Key; ComponentLink3URL: https://datasheet.ciiva.com/8512/f3115-8512543.pdf?src-supplier=Avnet; ComponentLink3Description: https://datasheet.ciiva.com/8512/f3115-8512543.pdf?src-supplier=Avnet; ComponentLink4URL: https://datasheet.ciiva.com/17280/f3115-17280270.pdf?src-supplier=Avnet+Europe; ComponentLink4Description: https://datasheet.ciiva.com/17280/f3115-17280270.pdf?src-supplier=Avnet+Europe; ComponentLink5URL: https://datasheet.ciiva.com/22685/27262-22685038.pdf?src-supplier=Element14; ComponentLink5Description: https://datasheet.ciiva.com/22685/27262-22685038.pdf?src-supplier=Element14; Supplier Part Number 1: 399-9598-1-ND
LED1 LED2 LED5 = LOL29K-H2K1-24-Z: OSRAM - LO L29K-H2K1-24-Z - SMARTLED 0603 ORANGE; Manufacturer: Osram Opto; Lens Color: White; Forward Current: 20mA; Forward Voltage: 2.2V; Luminous Intensity: 9mcd; Viewing Angle: 160°; Test Current: 2mA; Lens Style: Flat,Diffused,Colorless,Rectangular; Dominant Wavelength: 606nm; Luminous Flux: 0.025lm; Number of Elements: 1; Reverse Voltage: 12V; Lens Transparency: Diffused; Lens Size: 0.8mm; Supplier 1: Digi-Key; Manufacturer Part Number: LOL29K-H2K1-24-Z; RoHS: Yes; Category: Uncategorized; Mount: Surface Mount; Case/Package: 0603; Number of Pins: 2; Color: Orange; Case Code (Metric): 1608; Case Code (Imperial): 0603; Min Operating Temperature: -40°C; Max Operating Temperature: 100°C; Packaging: Tape and Reel; Number of LEDs: 1; Illumination Color: Orange; Package Quantity: 5000; Length: 1.3mm; Width: 0.8mm; Height: 0.65mm; Depth: 0.8mm; Radiation Hardening: No; ComponentLink1URL: https://datasheet.ciiva.com/2112/00077105-0-2112904.pdf?src-supplier=Digi-Key; ComponentLink1Description: https://datasheet.ciiva.com/2112/00077105-0-2112904.pdf?src-supplier=Digi-Key; ComponentLink2URL: https://datasheet.ciiva.com/2112/00077105-0-2112905.pdf?src-supplier=Digi-Key; ComponentLink2Description: https://datasheet.ciiva.com/2112/00077105-0-2112905.pdf?src-supplier=Digi-Key; ComponentLink3URL: https://datasheet.ciiva.com/2112/00077105-0-2112906.pdf?src-supplier=Digi-Key; ComponentLink3Description: https://datasheet.ciiva.com/2112/00077105-0-2112906.pdf?src-supplier=Digi-Key; ComponentLink4URL: https://datasheet.ciiva.com/15198/getdatasheetpartid-693885-15198412.pdf?src-supplier=Verical; ComponentLink4Description: https://datasheet.ciiva.com/15198/getdatasheetpartid-693885-15198412.pdf?src-supplier=Verical; Supplier Part Number 1: 475-2740-2-ND
LED3 LED4 LED6 = LGL29K-F2J1-24-Z: LED Uni-Color Green 572nm Automotive 2-Pin Chip 0603(1608Metric) T/R; Manufacturer: Osram Opto; Lens Color: White; Forward Current: 20mA; Forward Voltage: 1.7V; Luminous Intensity: 3.5mcd; Viewing Angle: 160°; Lens Style: Flat,Diffused,Colorless,Rectangular; Lens Transparency: Diffused; Test Current: 2mA; Dominant Wavelength: 570nm; Luminous Flux: 0.015lm; Number of LEDs: 1; Lens Size: 0.8mm; Supplier 1: Digi-Key; Manufacturer Part Number: LGL29K-F2J1-24-Z; RoHS: Yes; Category: Uncategorized; Stock 1: 70173; Pricing 1: 1=0.360000, 10=0.236000, 100=0.157600, 500=0.108980, 1000=0.090820, 2000=0.081740 (USD); Mount: Surface Mount; Case/Package: 0603; Number of Pins: 2; Color: Green; Case Code (Metric): 1608; Case Code (Imperial): 0603; Min Operating Temperature: -40°C; Max Operating Temperature: 100°C; Packaging: Tape and Reel; Package Quantity: 5000; Illumination Color: Green; Length: 1.7mm; Width: 0.8mm; Height: 0.65mm; Radiation Hardening: No; ComponentLink1URL: http://components.arrow.com/part/dataview/41971649S9781339N2128?src-supplier=Arrow+Electronics; ComponentLink1Description: http://components.arrow.com/part/dataview/41971649S9781339N2128?src-supplier=Arrow+Electronics; ComponentLink2URL: http://components.arrow.com/part/dataview/0323_02006818?src-supplier=Arrow+Europe; ComponentLink2Description: http://components.arrow.com/part/dataview/0323_02006818?src-supplier=Arrow+Europe; ComponentLink3URL: http://catalog.osram-os.com/catalogue/catalogue.do;jsessionid=3DE84243E85F820603DAFD5199D8DDA3?act=downloadFile&favOid=020000020000138e000100b6&src-supplier=Avnet; ComponentLink3Description: http://catalog.osram-os.com/catalogue/catalogue.do;jsessionid=3DE84243E85F820603DAFD5199D8DDA3?act=downloadFile&favOid=020000020000138e000100b6&src-supplier=Avnet; ComponentLink4URL: https://dammedia.osram.info/media/resource/hires/osram-dam-2493945/LG%20L29K.pdf?src-supplier=Digi-Key; ComponentLink4Description: https://dammedia.osram.info/media/resource/hires/osram-dam-2493945/LG%20L29K.pdf?src-supplier=Digi-Key; ComponentLink5URL: http://catalog.osram-os.com/catalogue/catalogue.do;jsessionid=3DE84243E85F820603DAFD5199D8DDA3?act=downloadFile&favOid=020000020000138e000100b6&src-supplier=Avnet+Europe; ComponentLink5Description: http://catalog.osram-os.com/catalogue/catalogue.do;jsessionid=3DE84243E85F820603DAFD5199D8DDA3?act=downloadFile&favOid=020000020000138e000100b6&src-supplier=Avnet+Europe; Supplier Part Number 1: 475-3118-1-ND
LINK1-LINK3 = QPC02SXGN-RC: CONN JUMPER SHORTING .100" GOLD; Manufacturer: Sullins; Number of Positions: 2; Pitch: 0.1inch; Supplier 1: Digi-Key; Manufacturer Part Number: QPC02SXGN-RC; RoHS: Yes; Category: Connectors; Stock 1: 770847; Pricing 1: 1=0.10000, 25=0.04400, 50=0.03780, 250=0.03152, 750=0.02835, 1000=0.02646, 12000=0.02016, 24000=0.01827, 48000=0.01820 (USD); Case/Package: 100; Contact Plating: Gold; Package Quantity: 2000; Packaging: Bulk; Height: 0.235inch; Lead Free: Lead Free; ComponentLink1URL: https://datasheet.ciiva.com/767/284-sxgn-11510-767869.pdf?src-supplier=Digi-Key; ComponentLink1Description: https://datasheet.ciiva.com/767/284-sxgn-11510-767869.pdf?src-supplier=Digi-Key; Supplier Part Number 1: S9337-ND
P1 = CMP-1712-00002-4: THT Vertical Pin Header WR-PHD, Pitch 2.54 mm, Single Row, 2 pins; Manufacturer: Wurth Elektronik; Rated Current: 3A; Gender: Male; Withstanding Voltage: 500VAC; Working Voltage: 250VAC; Pitch: 2.54mm; Contact Resistance: 20mOhm; Pin Number: 2; Mounting Technology: THT; Orientation: Vertical; Operating Temperature: -40to105degC; Packaging: Bag; Publisher: WurthElektronik; Datasheet URL: https://katalog.we-online.de/em/datasheet/6130xx11121.pdf; Manufacturer URL: http://www.we-online.de; Row Number: Single; Package Reference: 61300211121; Part Number: 61300211121
Q1-Q4 Q6 = CMP-2000-04930-1: N-Channel Enhancement Mode Mosfet, 50 V, 0.2 A, -55 to 150 degC, 3-Pin SOT23, RoHS, Tape and Reel; Manufacturer: Diodes Inc; Brand: DiodesIncorporated; Unit Weight: 0.000282oz; Pd - Power Dissipation: 300mW; Id - Continuous Drain Current: 200mA; Rds On - Drain-Source Resistance: 3.5Ohms; Vgs - Gate-Source Voltage: 20V; Number of Channels: 1Channel; Vds - Drain-Source Breakdown Voltage: 50V; Transistor Type: 1N-Channel; Typical Turn-Off Delay Time: 20ns; Configuration: Single; Mounting Style: SMD/SMT; Height: 1mm; Package Description: 3-Pin Small Outline Transistor, Body 2.9 x 1.3 mm, Pitch 0.96 mm; Datasheet Version: Rev. 20-2, 11/2013; Minimum Operating Temperature: -55C; Package / Case: SOT-23-3; Channel Mode: Enhancement; Product: MOSFETSmallSignal; Packaging: Reel; Maximum Operating Temperature: +150C; Datasheet URL: https://datasheet.ciiva.com/8115/ds30144-8115344.pdf; Product Category: MOSFET; Width: 1.3mm; Technology: Si; Package Reference: SOT23-3; Manufacturer URL: http://www.diodes.com/; Transistor Polarity: N-Channel; Length: 2.9mm; Factory Pack Quantity: 3000; Series: BSS138; RoHS: True; Typical Turn-On Delay Time: 20ns
Q5 = CMP-2000-05569-1: General Purpose Small Signal Amplifier, 150 mA, 50 V, -55 to 150 degC, 3-Pin SOT23 (SOT-346), RoHS, Tape and Reel; Manufacturer: Rohm; Maximum Operating Frequency: 180MHz; Transistor Type: NPN; Maximum DC Collector Current: 0.15A; Maximum Collector Base Voltage: 60V; Transistor Configuration: Single; Number of Elements per Chip: 1; Minimum DC Current Gain: 180; Maximum Power Dissipation: 0.2W; Maximum Collector Emitter Voltage: 50V; Maximum Emitter Base Voltage: 7V; Maximum Collector Emitter Saturation Voltage: 0.4V; Height: 1.1mm; Minimum Operating Temperature: -55°C; Pin Count: 3; Package Reference: SOT-346; Package Description: 3-Pin Small Outline Transistor, Body 2.9 x 1.65 mm, Pitch 0.95 mm; Width: 1.6mm; Package Type: SMT; Datasheet Version: Rev. 003, 08/2015; Dimensions: 1.1x2.9x1.6mm; Mounting Technology: SurfaceMount; Datasheet URL: http://rohmfs.rohm.com/en/products/databook/datasheet/discrete/transistor/bipolar/2sc2412kt146q-e.pdf; Manufacturer URL: http://www.rohm.com/web/global/; Length: 2.9mm; Mounting Type: SurfaceMount; Maximum Operating Temperature: +150°C
R1-R3 R7-R10 R14-R16 R18 R19 R34-R36 R44-R46 = AC0603FR-0710KL: RES SMD 10K OHM 1% 1/10W 0603; Manufacturer: Yageo; Resistance: 10kR; Power Rating: 100mW; Voltage Rating: 50V; Temperature Coefficient: 100ppm/°C; Supplier 1: Digi-Key; Manufacturer Part Number: AC0603FR-0710KL; RoHS: Yes; Category: Chip SMD Resistors; Stock 1: 1476724; Pricing 1: 1=0.10000, 10=0.02500, 100=0.01020, 1000=0.00458, 2500=0.00398 (USD); Mount: Surface Mount; Case/Package: 0603; Case Code (Imperial): 0603; Case Code (Metric): 1608; Min Operating Temperature: -55°C; Max Operating Temperature: 155°C; Tolerance: 1%; Packaging: Tape and Reel; Package Quantity: 1; Termination: SMD/SMT; Resistor Type: Thick Film; Number of Terminations: 2; Max Power Dissipation: 100mW; Features: Moisture Resistant,Automotive AEC-Q200,Anti-Sulfur; Length: 1.6mm; Width: 0.8mm; Height: 0.022inch; Depth: 0.8mm; Military Standard: Not; Lead Free: Lead Free; ComponentLink1URL: https://datasheet.ciiva.com/26862/getdatasheetpartid-724997-26862461.pdf?src-supplier=Verical; ComponentLink1Description: https://datasheet.ciiva.com/26862/getdatasheetpartid-724997-26862461.pdf?src-supplier=Verical; Supplier Part Number 1: 311-10KLDCT-ND
R4 R5 R21 R31 R32 R38 R39 = RC0603FR-07100KL: Res Thick Film 1.6 x 0.8 mm 100K Ohm 1% 0.1W(1/10W) 100ppm/ C Molded SMD Paper T/R; Manufacturer: Yageo; Resistance: 100kR; Temperature Coefficient: 100ppm/°C; Voltage Rating (DC): 50V; Power Rating: 100mW; Working Voltage: 75V; Supplier 1: Digi-Key; Manufacturer Part Number: RC0603FR-07100KL; RoHS: Yes; Category: Chip SMD Resistors; Stock 1: 10070605; Pricing 1: 1=0.10000, 10=0.02100, 100=0.00840, 1000=0.00379, 2500=0.00329 (USD); Case/Package: 0603; Number of Pins: 2; Case Code (Imperial): 0603; Case Code (Metric): 1608; Min Operating Temperature: -55°C; Max Operating Temperature: 155°C; Tolerance: 1%; Resistor Type: Thick Film; Packaging: Tape and Reel; Voltage Rating: 50V; Termination: SMD/SMT; Number of Terminations: 2; Length: 1.6mm; Width: 0.8mm; Height: 0.45mm; Depth: 0.8mm; REACH SVHC: No SVHC; Lead Free: Lead Free; Military Standard: Not; ComponentLink1URL: https://datasheet.ciiva.com/11808/0900766b80f96399-11808107.pdf?src-supplier=RSComponents; ComponentLink1Description: https://datasheet.ciiva.com/11808/0900766b80f96399-11808107.pdf?src-supplier=RSComponents; ComponentLink2URL: https://datasheet.ciiva.com/7983/443971-7983593.pdf?src-supplier=Element14; ComponentLink2Description: https://datasheet.ciiva.com/7983/443971-7983593.pdf?src-supplier=Element14; ComponentLink3URL: https://datasheet.ciiva.com/46440/1868787-46440889.pdf?src-supplier=Element14; ComponentLink3Description: https://datasheet.ciiva.com/46440/1868787-46440889.pdf?src-supplier=Element14; ComponentLink4URL: https://datasheet.ciiva.com/7746/1738695-7746234.pdf?src-supplier=Element14; ComponentLink4Description: https://datasheet.ciiva.com/7746/1738695-7746234.pdf?src-supplier=Element14; ComponentLink5URL: https://datasheet.ciiva.com/7746/1738695-7746235.pdf?src-supplier=Element14; ComponentLink5Description: https://datasheet.ciiva.com/7746/1738695-7746235.pdf?src-supplier=Element14; ComponentLink6URL: https://datasheet.ciiva.com/22747/443971-22747516.pdf?src-supplier=Element14; ComponentLink6Description: https://datasheet.ciiva.com/22747/443971-22747516.pdf?src-supplier=Element14; Supplier Part Number 1: 311-100KHRCT-ND
R6 = CMP-2000-00370-1: Part Number: ERJ-3EKF2492V; Manufacturer: Panasonic
R11-R13 R24 = RC0603FR-070RL: YAGEO - RC0603FR-070RL - RES, THICK FILM, 0R, 1%, 0.1W, 0603; Resistance: 0mR; Power Rating: 100mW; Voltage Rating (DC): 50V; Temperature Coefficient: 200ppm/°C; Current Rating: 1A; Working Voltage: 75V; Supplier 1: Digi-Key; Manufacturer: Yageo; Manufacturer Part Number: RC0603FR-070RL; RoHS: Yes; Category: Chip SMD Resistors; Stock 1: 509264; Pricing 1: 1=0.10000, 10=0.01800, 25=0.01280, 50=0.00980, 100=0.00730, 250=0.00552, 500=0.00442, 1000=0.00326 (USD); Case/Package: 0603; Number of Pins: 2; Contact Plating: Tin,Matte; Case Code (Metric): 1608; Case Code (Imperial): 0603; Min Operating Temperature: -55°C; Max Operating Temperature: 155°C; Resistor Type: Thick Film; Packaging: Tape and Reel; Tolerance: 1%; Package Quantity: 5000; Voltage Rating: 50V; Number of Terminations: 2; Termination: SMD/SMT; Max Power Dissipation: 100mW; Features: Moisture Resistant; Length: 1.6mm; Width: 0.031inch; Height: 0.45mm; Depth: 0.8mm; Radiation Hardening: No; REACH SVHC: No SVHC; Lead Free: Lead Free; Military Standard: Not; ComponentLink1URL: https://datasheet.ciiva.com/11808/0900766b80f96399-11808172.pdf?src-supplier=RSComponents; ComponentLink1Description: https://datasheet.ciiva.com/11808/0900766b80f96399-11808172.pdf?src-supplier=RSComponents; ComponentLink2URL: https://datasheet.ciiva.com/5558/rc0603-272842-5558341.pdf?src-supplier=Mouser; ComponentLink2Description: https://datasheet.ciiva.com/5558/rc0603-272842-5558341.pdf?src-supplier=Mouser; ComponentLink3URL: https://datasheet.ciiva.com/46382/443971-46382072.pdf?src-supplier=Element14; ComponentLink3Description: https://datasheet.ciiva.com/46382/443971-46382072.pdf?src-supplier=Element14; ComponentLink4URL: https://datasheet.ciiva.com/29721/pyu-r-int-thick-7-29721178.pdf?src-supplier=Digi-Key; ComponentLink4Description: https://datasheet.ciiva.com/29721/pyu-r-int-thick-7-29721178.pdf?src-supplier=Digi-Key; ComponentLink5URL: https://datasheet.ciiva.com/5684/443971-5684699.pdf?src-supplier=Farnell; ComponentLink5Description: https://datasheet.ciiva.com/5684/443971-5684699.pdf?src-supplier=Farnell; ComponentLink6URL: https://datasheet.ciiva.com/7983/443971-7983627.pdf?src-supplier=Element14; ComponentLink6Description: https://datasheet.ciiva.com/7983/443971-7983627.pdf?src-supplier=Element14; ComponentLink7URL: https://datasheet.ciiva.com/29721/pyu-rc0603-51-rohs-l-4-29721179.pdf?src-supplier=Digi-Key; ComponentLink7Description: https://datasheet.ciiva.com/29721/pyu-rc0603-51-rohs-l-4-29721179.pdf?src-supplier=Digi-Key; ComponentLink8URL: https://datasheet.ciiva.com/22643/1868787-22643388.pdf?src-supplier=Element14; ComponentLink8Description: https://datasheet.ciiva.com/22643/1868787-22643388.pdf?src-supplier=Element14; Supplier Part Number 1: 311-0.0HRCT-ND